# EAGLE design SRAM 4MB 2048kbx8 CPLD_v1_2 (EAGLE 6.4)
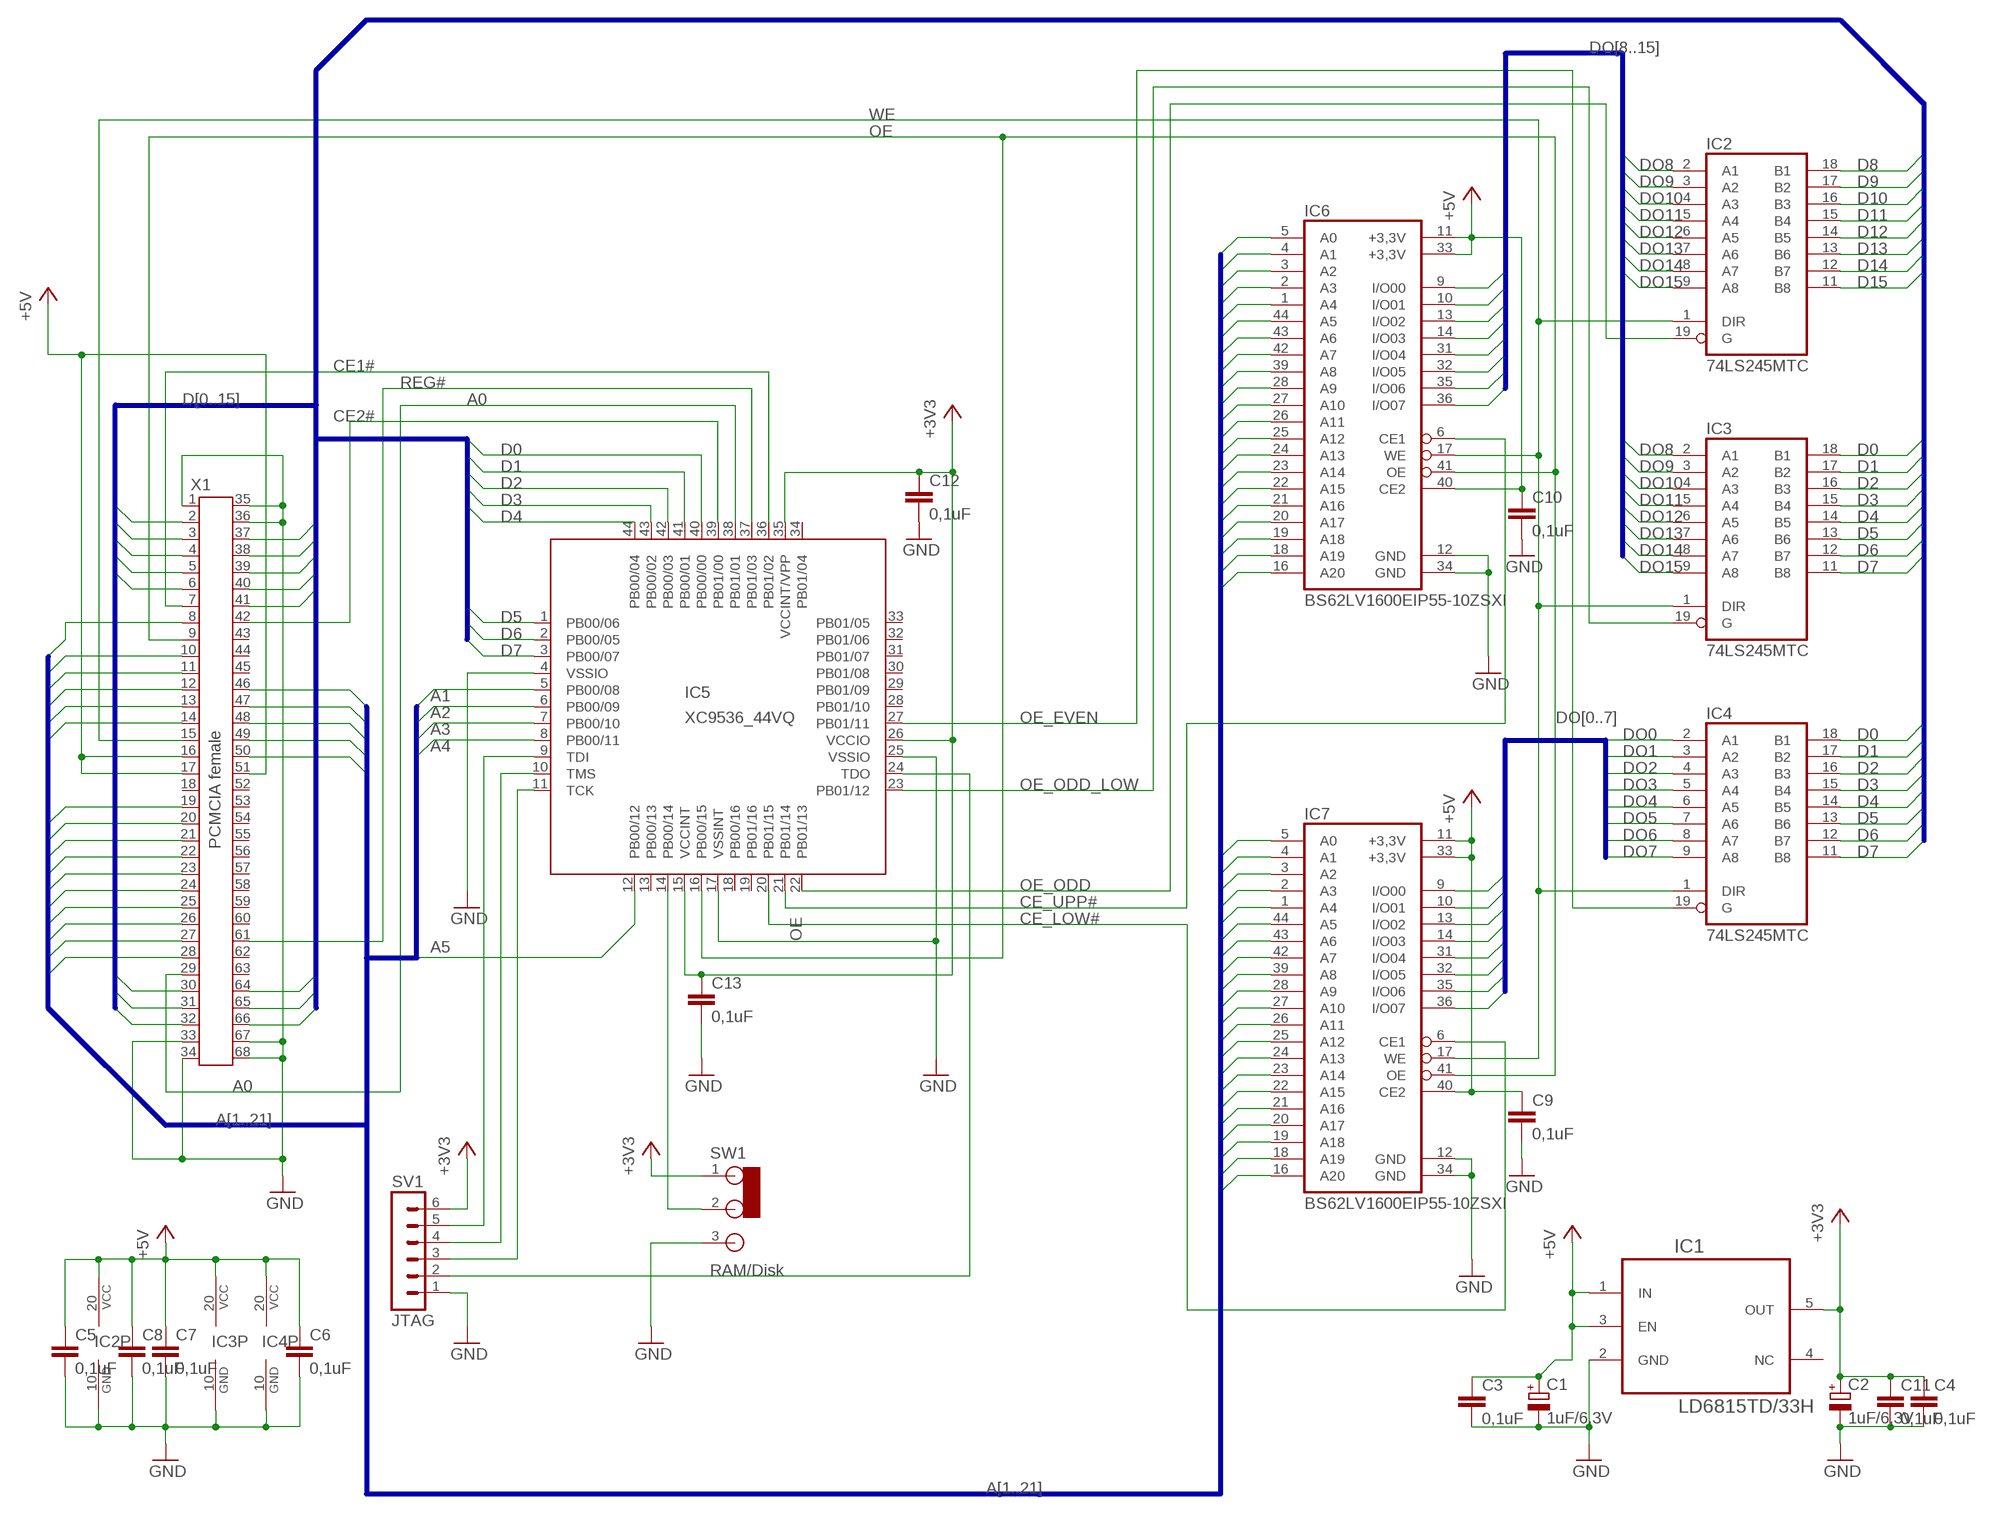
[diagram p0: schematic, sheet 1]

## Parts
C1  1uF/6,3V  CPOL-EUA/3216-18R  [A/3216-18R]
C2  1uF/6,3V  CPOL-EUA/3216-18R  [A/3216-18R]
C3  0,1uF  C-EUC0603  [C0603]
C4  0,1uF  C-EUC0603  [C0603]
C5  0,1uF  C-EUC0603  [C0603]
C6  0,1uF  C-EUC0603  [C0603]
C7  0,1uF  C-EUC0603  [C0603]
C8  0,1uF  C-EUC0603  [C0603]
C9  0,1uF  C-EUC0603  [C0603]
C10  0,1uF  C-EUC0603  [C0603]
C11  0,1uF  C-EUC0603  [C0603]
C12  0,1uF  C-EUC0603  [C0603]
C13  0,1uF  C-EUC0603  [C0603]
IC1  LD6815TD/33H  [SOT95P275X110-5N]
IC2  74LS245MTC  [TSSOP20]
IC3  74LS245MTC  [TSSOP20]
IC4  74LS245MTC  [TSSOP20]
IC5  XC9536_44VQ  [SQFP-S-10X10-44]
IC6  BS62LV1600EIP55-10ZSXI  [TSOPII-Z44]
IC7  BS62LV1600EIP55-10ZSXI  [TSOPII-Z44]
SV1  JTAG  MA06-1  [MA06-1]
SW1  RAM/Disk  AYZ0102AGRLC  [SWITCH2]
X1  PCMCIA female  9M681X03TB9M681Z04  [9M681X04]

## Nets
+3V3 [+3.3V]: C2.+ C4.1 C11.1 C12.1 C13.1 IC1.5(OUT) IC5.15(VCCINT) IC5.26(VCCIO) IC5.35(VCCINT/VPP) SV1.6 SW1.1
+5V [+5V]: C1.+ C3.1 C5.1 C6.1 C7.1 C8.1 C9.1 C10.1 IC1.1(IN) IC1.3(EN) IC2.20(VCC) IC3.20(VCC) IC4.20(VCC) IC6.11(+3,3V) IC6.33(+3,3V) IC6.40(CE2) IC7.11(+3,3V) IC7.33(+3,3V) IC7.40(CE2) X1.16 X1.17 X1.51
A0: IC5.38(PB01/01) X1.29
A1: IC5.5(PB00/08) IC6.5(A0) IC7.5(A0) X1.28
A2: IC5.6(PB00/09) IC6.4(A1) IC7.4(A1) X1.27
A3: IC5.7(PB00/10) IC6.3(A2) IC7.3(A2) X1.26
A4: IC5.8(PB00/11) IC6.2(A3) IC7.2(A3) X1.25
A5: IC5.12(PB00/12) IC6.1(A4) IC7.1(A4) X1.24
A6: IC6.44(A5) IC7.44(A5) X1.23
A7: IC6.43(A6) IC7.43(A6) X1.22
A8: IC6.42(A7) IC7.42(A7) X1.12
A9: IC6.39(A8) IC7.39(A8) X1.11
A10: IC6.28(A9) IC7.28(A9) X1.8
A11: IC6.27(A10) IC7.27(A10) X1.10
A12: IC6.26(A11) IC7.26(A11) X1.21
A13: IC6.25(A12) IC7.25(A12) X1.13
A14: IC6.24(A13) IC7.24(A13) X1.14
A15: IC6.23(A14) IC7.23(A14) X1.20
A16: IC6.22(A15) IC7.22(A15) X1.19
A17: IC6.21(A16) IC7.21(A16) X1.46
A18: IC6.20(A17) IC7.20(A17) X1.47
A19: IC6.19(A18) IC7.19(A18) X1.48
A20: IC6.18(A19) IC7.18(A19) X1.49
A21: IC6.16(A20) IC7.16(A20) X1.50
CE1#: IC5.36(PB01/02) X1.7
CE2#: IC5.39(PB01/00) X1.42
CE_LOW#: IC5.20(PB01/15) IC7.6(CE1)
CE_UPP#: IC5.21(PB01/14) IC6.6(CE1)
D0: IC3.18(B1) IC4.18(B1) IC5.40(PB00/00) X1.30
D1: IC3.17(B2) IC4.17(B2) IC5.41(PB00/01) X1.31
D2: IC3.16(B3) IC4.16(B3) IC5.42(PB00/03) X1.32
D3: IC3.15(B4) IC4.15(B4) IC5.43(PB00/02) X1.2
D4: IC3.14(B5) IC4.14(B5) IC5.44(PB00/04) X1.3
D5: IC3.13(B6) IC4.13(B6) IC5.1(PB00/06) X1.4
D6: IC3.12(B7) IC4.12(B7) IC5.2(PB00/05) X1.5
D7: IC3.11(B8) IC4.11(B8) IC5.3(PB00/07) X1.6
D8: IC2.18(B1) X1.64
D9: IC2.17(B2) X1.65
D10: IC2.16(B3) X1.66
D11: IC2.15(B4) X1.37
D12: IC2.14(B5) X1.38
D13: IC2.13(B6) X1.39
D14: IC2.12(B7) X1.40
D15: IC2.11(B8) X1.41
DO0: IC4.2(A1) IC7.9(I/O00)
DO1: IC4.3(A2) IC7.10(I/O01)
DO2: IC4.4(A3) IC7.13(I/O02)
DO3: IC4.5(A4) IC7.14(I/O03)
DO4: IC4.6(A5) IC7.31(I/O04)
DO5: IC4.7(A6) IC7.32(I/O05)
DO6: IC4.8(A7) IC7.35(I/O06)
DO7: IC4.9(A8) IC7.36(I/O07)
DO8: IC2.2(A1) IC3.2(A1) IC6.9(I/O00)
DO9: IC2.3(A2) IC3.3(A2) IC6.10(I/O01)
DO10: IC2.4(A3) IC3.4(A3) IC6.13(I/O02)
DO11: IC2.5(A4) IC3.5(A4) IC6.14(I/O03)
DO12: IC2.6(A5) IC3.6(A5) IC6.31(I/O04)
DO13: IC2.7(A6) IC3.7(A6) IC6.32(I/O05)
DO14: IC2.8(A7) IC3.8(A7) IC6.35(I/O06)
DO15: IC2.9(A8) IC3.9(A8) IC6.36(I/O07)
GND [Ground]: C1.- C2.- C3.2 C4.2 C5.2 C6.2 C7.2 C8.2 C9.2 C10.2 C11.2 C12.2 C13.2 IC1.2(GND) IC2.10(GND) IC3.10(GND) IC4.10(GND) IC5.4(VSSIO) IC5.17(VSSINT) IC5.25(VSSIO) IC6.12(GND) IC6.34(GND) IC7.12(GND) IC7.34(GND) SV1.1 SW1.3 X1.1 X1.33 X1.34 X1.35 X1.36 X1.67 X1.68
N$1: IC5.24(TDO) SV1.2
N$2: IC5.11(TCK) SV1.3
N$3: IC5.10(TMS) SV1.4
N$4: IC5.9(TDI) SV1.5
N$8: IC5.14(PB00/14) SW1.2
OE: IC5.16(PB00/15) IC6.41(OE) IC7.41(OE) X1.9
OE_EVEN: IC4.19(G) IC5.27(PB01/11)
OE_ODD: IC2.19(G) IC5.22(PB01/13)
OE_ODD_LOW: IC3.19(G) IC5.23(PB01/12)
REG#: IC5.37(PB01/03) X1.61
WE: IC2.1(DIR) IC3.1(DIR) IC4.1(DIR) IC6.17(WE) IC7.17(WE) X1.15
Unconnected: IC1.4(NC) IC5.13(PB00/13) IC5.18(PB00/16) IC5.19(PB01/16) IC5.28(PB01/10) IC5.29(PB01/09) IC5.30(PB01/08) IC5.31(PB01/07) IC5.32(PB01/06) IC5.33(PB01/05) IC5.34(PB01/04) X1.18 X1.43 X1.44 X1.45 X1.52 X1.53 X1.54 X1.55 X1.56 X1.57 X1.58 X1.59 X1.60 X1.62 X1.63

## Buses
DO[8..15]
DO[0..7]
D[0..15]
A[1..21]

## Library data of the parts
C1 C2 = resistor:CPOL-EU: POLARIZED CAPACITOR, European symbol
C3-C13 = resistor:C-EU: CAPACITOR, European symbol
IC1 = NXP:LD6815TD/33H: LDO, 5.5V, 0.25VDO, 0.15A, 3.3V, 5TSOP; MPN: LD6815TD/33H; OC_FARNELL: 2308302; OC_NEWARK: 69W9575; PACKAGE: TSOP-5; SUPPLIER: NXP
IC2-IC4 = 74xx-us:74*245: Octal BUS TRANSCEIVER, 3-state
IC5 = xilinx-xc9:XC9536_44VQ: xc9536_pc44 XC9500 In-System Programmable CPLD Family Auto generated by make-symbol-device-package-bsdl.ulp Rev. 34 Source: xc9536_vq44.bsd; MPN: XC9536-15VQG44C; OC_FARNELL: 1193227; OC_NEWARK: 98K3377
IC6 IC7 = BSI_By_element14_Batch_1:BS62LV1600EIP55: Source: CYPRESS cy7c1059dv33_8.pdf
SV1 = con-lstb:MA06-1: PIN HEADER; OC_FARNELL: unknown; OC_NEWARK: unknown
SW1 = amiga:AYZ0102AGRLC: SWITCH
X1 = 3M:9M681X03TB

## Net classes
0 default: width 0.102 mm
1 Ground: width 0.254 mm
2 +5V: width 0.254 mm
3 +3.3V: width 0.254 mm

## Board
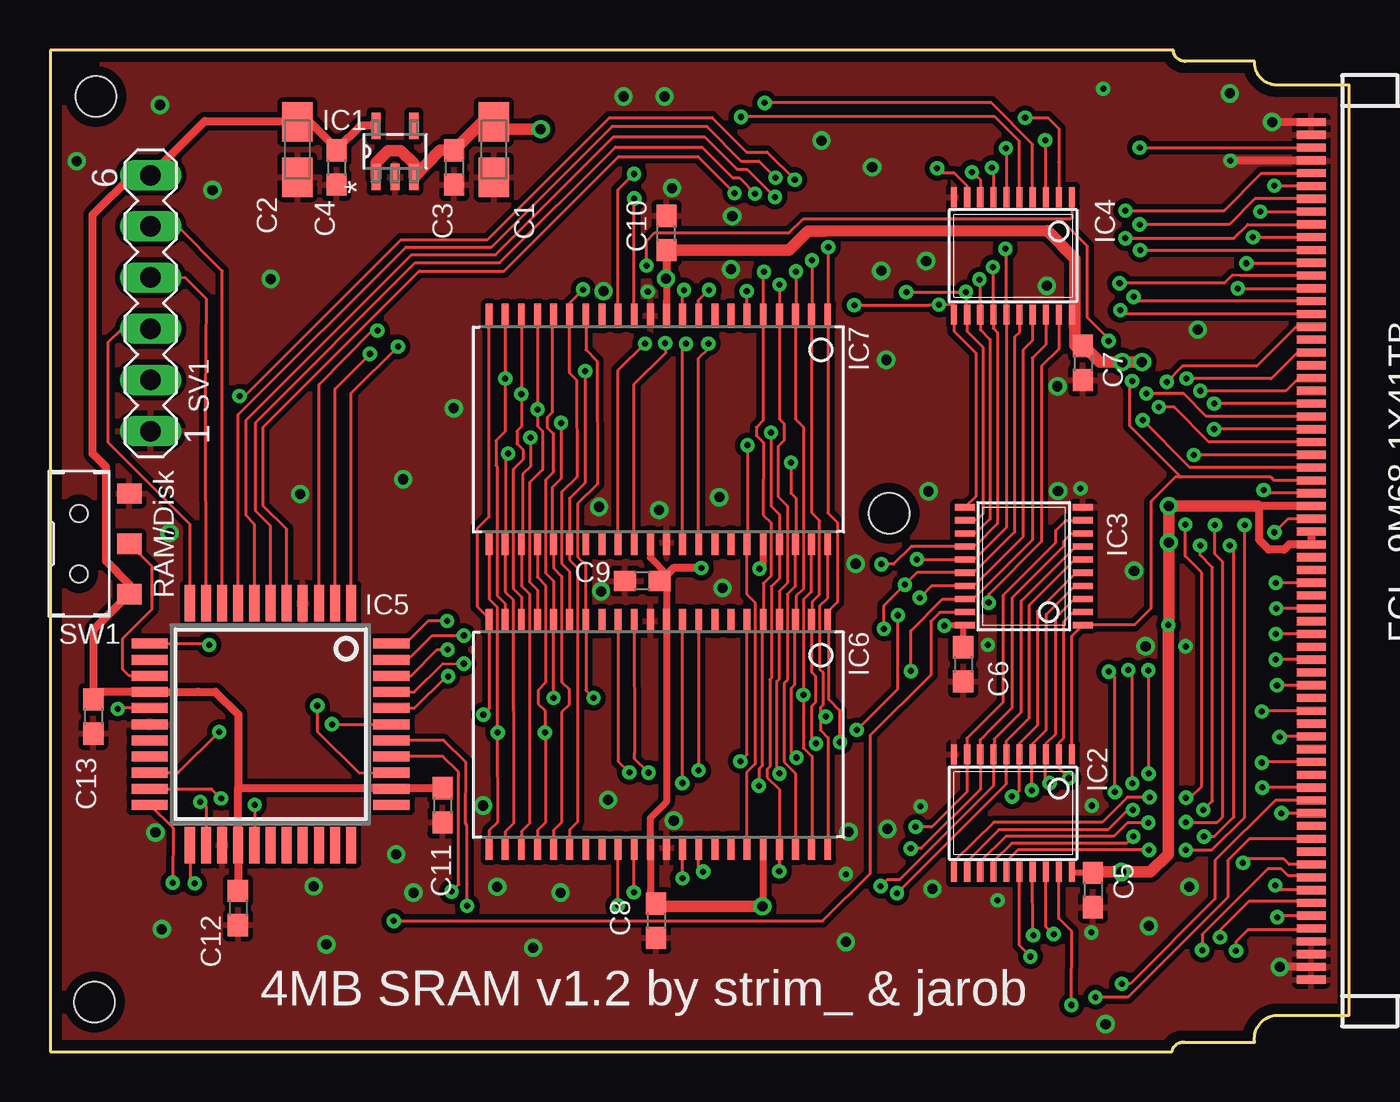
[diagram p1: board, top side]
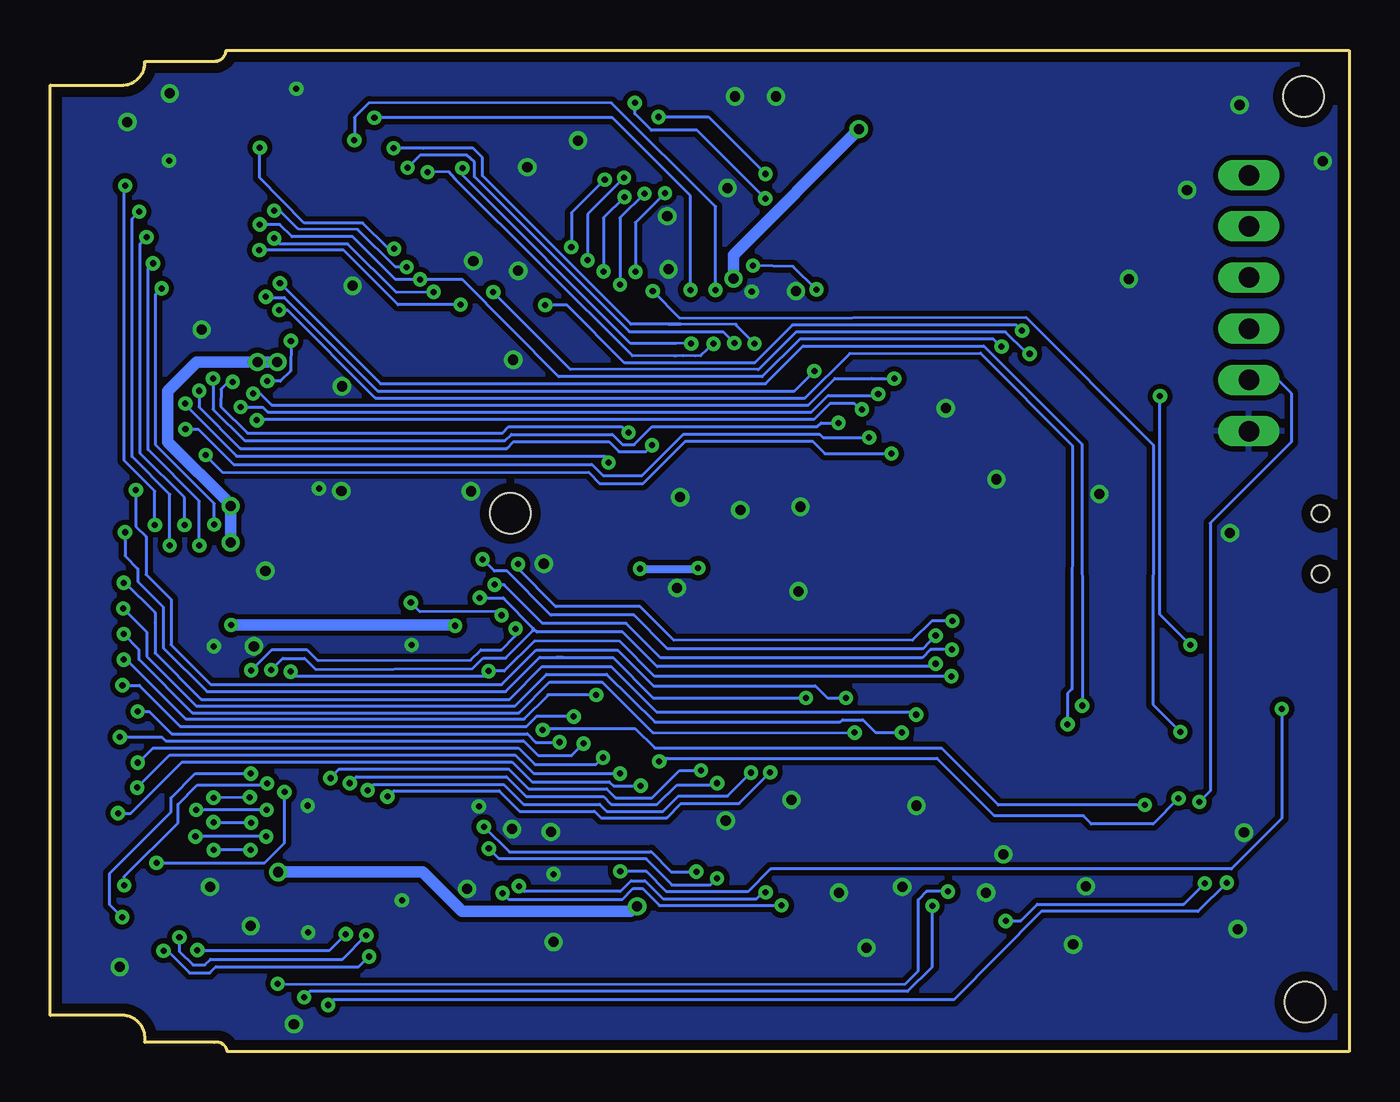
[diagram p2: board, bottom side, seen from below]

Size 64.43 x 49.67 mm. Coordinates in mm from the lower left corner, seen from the top.
Outline: 0,0 55.65,0 arc-90 56.28,0.46 59.74,0.46 arc-90 60.73,1.79 64.43,1.79 64.43,47.94 60.8,47.94 arc-90 59.74,49.13 56.31,49.13 arc-90 55.71,49.67 0,49.67 0,0
Copper layers (1*16): Top 0.035mm / dielectric 1.5mm / Bottom 0.035mm
Design rules "default *": minimum track width 0.015mm, minimum drill 0.03mm, track to track 4mil, track to pad 6mil, pad to pad 6mil, via to via 6mil, smd to smd 6mil, copper to edge 20mil, drill to drill 8mil, minimum pad ring 10mil, minimum via ring 8mil, stop-mask expansion 4mil, vias tented up to drill 20mil, thermal gap 10mil
Holes 2 mm at 2.19,2.46 2.25,47.38 41.61,26.7

### Footprints (pad centres in the part's own frame; a part is rotated, then mirrored left to right if it is on the bottom)
A/3216-18R = smd 1.95 x 1.5: + 1.375,0; - -1.375,0
C0603 = smd 1.1 x 1: 1 -0.85,0; 2 0.85,0
SOT95P275X110-5N = smd 1.321 x 0.457: 1 -1.27,0.94; 2 -1.27,0; 3 -1.27,-0.94; 4 1.27,-0.94; 5 1.27,0.94
TSSOP20 = smd 0.305 x 0.991: 1 -2.925,-2.918; 2 -2.275,-2.918; 3 -1.625,-2.918; 4 -0.975,-2.918; 5 -0.325,-2.918; 6 0.325,-2.918; 7 0.975,-2.918; 8 1.625,-2.918; 9 2.275,-2.918; 10 2.925,-2.918; 11 2.925,2.918; 12 2.275,2.918; 13 1.625,2.918; 14 0.975,2.918; 15 0.325,2.918; 16 -0.325,2.918; 17 -0.975,2.918; 18 -1.625,2.918; 19 -2.275,2.918; 20 -2.925,2.918
SQFP-S-10X10-44 = smd 0.5 x 1.8: 1 -4,-6; 2 -3.2,-6; 3 -2.4,-6; 4 -1.6,-6; 5 -0.8,-6; 6 0,-6; 7 0.8,-6; 8 1.6,-6; 9 2.4,-6; 10 3.2,-6; 11 4,-6; 23 4,6; 24 3.2,6; 25 2.4,6; 26 1.6,6; 27 0.8,6; 28 0,6; 29 -0.8,6; 30 -1.6,6; 31 -2.4,6; 32 -3.2,6; 33 -4,6 | smd 1.8 x 0.5: 12 6,-4; 13 6,-3.2; 14 6,-2.4; 15 6,-1.6; 16 6,-0.8; 17 6,0; 18 6,0.8; 19 6,1.6; 20 6,2.4; 21 6,3.2; 22 6,4; 34 -6,4; 35 -6,3.2; 36 -6,2.4; 37 -6,1.6; 38 -6,0.8; 39 -6,0; 40 -6,-0.8; 41 -6,-1.6; 42 -6,-2.4; 43 -6,-3.2; 44 -6,-4
TSOPII-Z44 = smd 0.34 x 1.2: 1 -8.4,-5.627; 2 -7.6,-5.627; 3 -6.8,-5.627; 4 -6,-5.627; 5 -5.2,-5.627; 6 -4.4,-5.627; 7 -3.6,-5.627; 8 -2.8,-5.627; 9 -2,-5.627; 10 -1.2,-5.627; 11 -0.4,-5.627; 12 0.4,-5.627; 13 1.2,-5.627; 14 2,-5.627; 15 2.8,-5.627; 16 3.6,-5.627; 17 4.4,-5.627; 18 5.2,-5.627; 19 6,-5.627; 20 6.8,-5.627; 21 7.6,-5.627; 22 8.4,-5.627; 23 8.4,5.627; 24 7.6,5.627; 25 6.8,5.627; 26 6,5.627; 27 5.2,5.627; 28 4.4,5.627; 29 3.6,5.627; 30 2.8,5.627; 31 2,5.627; 32 1.2,5.627; 33 0.4,5.627; 34 -0.4,5.627; 35 -1.2,5.627; 36 -2,5.627; 37 -2.8,5.627; 38 -3.6,5.627; 39 -4.4,5.627; 40 -5.2,5.627; 41 -6,5.627; 42 -6.8,5.627; 43 -7.6,5.627; 44 -8.4,5.627
MA06-1 = drill 1.016 long: 1 -6.35,0; 2 -3.81,0; 3 -1.27,0; 4 1.27,0; 5 3.81,0; 6 6.35,0
SWITCH2 = smd 1 x 1.2: 1 -2.5,1; 2 0,1; 3 2.5,1 | hole 0.85: -1.5,3.5; 1.5,3.5
9M681X04 = smd 0.406 x 1.422: 1 -20.955,-3.175; 2 -19.685,-3.175; 3 -18.415,-3.175; 4 -17.145,-3.175; 5 -15.875,-3.175; 6 -14.605,-3.175; 7 -13.335,-3.175; 8 -12.065,-3.175; 9 -10.795,-3.175; 10 -9.525,-3.175; 11 -8.255,-3.175; 12 -6.985,-3.175; 13 -5.715,-3.175; 14 -4.445,-3.175; 15 -3.175,-3.175; 16 -1.905,-3.175; 17 -0.635,-3.175; 18 0.635,-3.175; 19 1.905,-3.175; 20 3.175,-3.175; 21 4.445,-3.175; 22 5.715,-3.175; 23 6.985,-3.175; 24 8.255,-3.175; 25 9.525,-3.175; 26 10.795,-3.175; 27 12.065,-3.175; 28 13.335,-3.175; 29 14.605,-3.175; 30 15.875,-3.175; 31 17.145,-3.175; 32 18.415,-3.175; 33 19.685,-3.175; 34 20.955,-3.175; 35 -20.32,-3.175; 36 -19.05,-3.175; 37 -17.78,-3.175; 38 -16.51,-3.175; 39 -15.24,-3.175; 40 -13.97,-3.175; 41 -12.7,-3.175; 42 -11.43,-3.175; 43 -10.16,-3.175; 44 -8.89,-3.175; 45 -7.62,-3.175; 46 -6.35,-3.175; 47 -5.08,-3.175; 48 -3.81,-3.175; 49 -2.54,-3.175; 50 -1.27,-3.175; 51 0,-3.175; 52 1.27,-3.175; 53 2.54,-3.175; 54 3.81,-3.175; 55 5.08,-3.175; 56 6.35,-3.175; 57 7.62,-3.175; 58 8.89,-3.175; 59 10.16,-3.175; 60 11.43,-3.175; 61 12.7,-3.175; 62 13.97,-3.175; 63 15.24,-3.175; 64 16.51,-3.175; 65 17.78,-3.175; 66 19.05,-3.175; 67 20.32,-3.175; 68 21.59,-3.175

### Placement (x,y rotation side)
C1  22,44.75 90 top
C2  12.26,44.75 90 top
C3  20.03,43.86 270 top
C4  14.19,43.86 270 top
C5  51.72,8.01 270 top
C6  45.28,19.21 270 top
C7  51.23,34.16 270 top
C8  30.05,6.49 270 top
C9  29.36,23.35 180 top
C10  30.56,40.61 90 top
C11  19.45,12.22 270 top
C12  9.3,7.12 270 top
C13  2.13,16.62 270 top
IC1  17.09,44.65 90 top
IC2  47.75,11.82 180 top
IC3  48.29,24.08 90 top
IC4  47.75,39.48 180 top
IC5  10.92,16.24 180 top
IC6  30.16,15.73 180 top
IC7  30.16,30.87 180 top
SV1  4.97,37.13 90 top
SW1  4.92,25.19 90 top
X1  65.72,25.16 270 top

### Tracks (layer width: path | path; a pad name or v marks a point on that pad's centre or on a via)
+3V3
  Top 0.305: 2.16,17.5 2.19,17.53 2.19,17.84
  Top 0.406: IC1.5 15.38,45.93 14.21,44.76 14.21,44.69 C4.1 14.38,44.61 12.93,46.06 12.26,46.06 C2.+ 12.12,46.16 7.66,46.16 SV1.6 5.02,43.52 4.08,43.49 2.1,41.51 2.1,29.67 2.76,29 2.76,24.33 3.92,23.17 SW1.1 2.16,20.93 2.16,17.5 C13.1 | 2.19,17.84 IC5.15 7.33,17.84 8.19,17.84 9.32,16.73 9.32,13.11 | IC5.26 | IC5.26 9.32,8.4 C12.1 | C12.1 9.37,7.99 | IC5.26 9.32,13.11 | 9.32,13.11 9.41,13.08 16.02,13.08 16.19,13.06 IC5.35 16.95,13.07 C11.1 | C12.1
+5V  (via drill 0.3, 0.5)
  Top 0.305: v44.35,21.13 45.35,21.13 IC3.20 45.28,21.06 C6.1 | v55.46,21.16 55.46,21.2 55.49,21.22 | 50.83,35.03 51.14,35.04 C7.1 50.69,35.15 IC4.20 | C5.1 50.72,8.86 IC2.20
  Top 0.34: IC7.11 30.56,36.87 | 30.56,36.87 30.56,37.24 | 29.76,11.59 30.56,12.39 IC6.11 30.56,21.38 30.56,23.18 | 29.76,11.59 | IC6.40 35.36,7.25 | 30.18,7.48 29.79,7.56 29.76,7.98 IC6.33 29.76,11.59 | IC7.40 35.36,24.14 v35.18,23.95 | v30.54,38.35 30.56,38.32 30.56,36.87 | IC7.33 29.76,24.5 30.59,23.67 30.56,23.18 | 30.54,23.22 30.56,23.22 30.56,23.18
  Top 0.406: X1.16 59.9,27.06 59.96,27 59.96,25.38 60.44,24.9 61.2,24.9 61.46,25.16 X1.51 X1.17 62.45,25.79 | 50.83,35.03 51.29,34.97 | 22.55,45.76 22.48,45.83 C1.+ 21.44,46.12 | 35.36,7.25 v35.32,7.21 35.36,7.21 | 30.44,7.21 30.18,7.48 30.05,7.35 C8.1 | v32.29,23.98 30.91,23.98 30.59,23.67 | 30.54,23.22 30.34,23.22 C9.1 | v30.54,38.35 30.56,38.37 C10.1 | v55.46,21.16 | 51.76,8.9 C5.1
  Top 0.559: 59.9,27.06 v55.49,27.06 55.49,21.22 | 50.83,35.03 50.83,39.34 49.45,40.72 38.42,40.71 37.59,40.71 36.64,39.75 C10.1 | 22.55,45.76 v24.32,45.76 | 21.44,46.12 C3.1 19.33,44.71 IC1.3 18.03,44.04 17.37,44.7 16.76,44.7 16.15,44.09 IC1.1 | 35.36,7.21 30.44,7.21 | v54.15,34.21 52.05,34.21 51.29,34.97 | v55.46,21.16 55.46,9.79 54.57,8.9 v53.12,8.9 51.76,8.9
  Bottom 0.305: v44.35,21.13 44.39,21.16
  Bottom 0.406: 35.64,6.95 v35.32,7.21 | 55.49,27.13 v55.49,27.06 | v35.18,23.95 32.32,23.95 v32.29,23.98
  Bottom 0.559: v24.32,45.76 30.54,39.52 v30.54,38.35 | 35.64,6.95 44.01,6.95 45.96,8.9 v53.12,8.9 | 55.49,27.13 58.6,30.24 58.6,32.78 57.16,34.21 v54.15,34.21 v53.17,34.21 | v55.49,25.25 v55.49,27.06 | 44.39,21.16 v55.46,21.16
A0  (via drill 0.3)
  Top 0.15: X1.29 59.49,10.55 58.41,9.47 58.41,7.65 53.45,2.69 v51.84,2.69 | v20.68,7.23 20.68,8.32 20.67,8.84 20.67,11.19 20.61,11.32 20.61,14.35 19.51,15.44 18.71,15.44 IC5.38
  Bottom 0.15: 51.82,2.69 v51.84,2.69 51.56,2.98 21.91,2.98 20.68,4.2 v20.68,7.23
A1  (via drill 0.3)
  Top 0.15: v33.94,42.59 32.13,44.4 28.19,44.4 22.52,38.72 18.3,38.72 10.54,30.96 10.54,27.1 11.72,25.91 IC5.5 | v35.4,38.68 35.36,38.74 IC7.5 35.36,31.31 35.02,30.97 35.02,30.55 35.36,30.21 35.36,26.63 35.76,26.22 35.76,23.62 35.37,23.22 IC6.5 35.34,21.33 35.34,14.2 35.18,14.04 35.18,13.19 v35.14,13.19 | X1.28 v61.07,11.82
  Bottom 0.15: v33.94,42.59 35.4,41.13 v35.4,38.68 | v61.07,11.82 60.44,11.82 57.9,14.36 41.53,14.36 40.54,13.38 36.7,13.38 36.48,13.19 v35.14,13.19
A2  (via drill 0.3)
  Top 0.15: v34.96,42.56 34.18,43.35 33.85,43.35 32.32,44.88 28.04,44.88 22.29,39.13 18.1,39.13 10.16,31.18 10.16,26.84 10.92,26.08 IC5.6 | v36.16,38.05 36.16,38.18 IC7.4 36.16,31.38 36.38,31.16 36.38,30.3 36.1,30.02 36.1,28.75 36.1,27.53 36.56,27.06 36.56,23.24 36.16,22.84 IC6.4 36.16,18.49 36.04,18.36 36.04,13.98 36.13,13.89 v36.16,13.79 | X1.27 v60.12,13.09
  Bottom 0.15: v34.96,42.56 36.17,41.37 v36.16,38.05 | v60.12,13.09 58.5,14.71 41.37,14.71 40.45,13.79 v36.16,13.79
A3  (via drill 0.3)
  Top 0.15: v35.94,42.4 34.56,43.77 34.07,43.76 32.48,45.35 27.9,45.35 22.09,39.53 17.91,39.53 9.72,31.34 9.72,26.59 10.12,26.15 IC5.7 | v36.98,38.7 36.98,36.44 IC7.3 36.96,31.38 37.37,30.97 37.36,30.95 37.36,22.95 36.99,22.59 36.99,21.38 IC6.3 36.93,21.32 36.93,18.21 36.77,18.05 36.77,14.83 36.96,14.64 v37.01,14.58 | X1.26 60.12,14.36 v60.09,14.33
  Bottom 0.15: v35.94,42.4 36.99,41.36 v36.98,38.7 | v60.09,14.33 60.06,14.33 59.33,15.06 41.21,15.06 40.39,14.24 37.37,14.24 37.14,14.47 v37.01,14.58
A4  (via drill 0.3)
  Top 0.15: IC5.8 9.32,31.6 17.63,39.92 21.88,39.92 27.86,45.89 32.58,45.89 34.26,44.18 35.15,44.18 v35.97,43.35 | v37.78,39.26 37.78,36.52 IC7.2 37.76,26.73 38.16,26.34 38.16,22.68 37.78,22.3 37.78,21.38 IC6.2 37.78,21.34 37.78,18.81 37.97,18.62 37.97,17.35 37.78,17.16 37.78,15.47 v37.97,15.28 | X1.25 61.01,15.63 v60.98,15.6
  Bottom 0.15: v35.97,43.35 37.78,41.54 v37.78,39.26 | v60.98,15.6 58.9,15.6 58.71,15.41 40.96,15.41 40.23,14.68 38.57,14.68 v37.97,15.28
A5  (via drill 0.3)
  Top 0.15: v36.93,43.26 35.55,44.63 34.54,44.62 32.83,46.34 27.75,46.34 21.69,40.27 17.39,40.27 9.63,32.52 v9.38,32.52 | v38.59,39.91 38.58,36.6 IC7.1 38.56,26.73 39.05,26.24 39.05,22.3 38.58,21.82 38.58,21.37 IC6.1 38.62,21.25 38.62,17.46 39.17,16.9 v39.17,15.35 | X1.24 60.12,16.9 v60.09,16.87 | IC5.12 7.81,20.24 v7.87,20.17
  Bottom 0.15: v36.93,43.26 38.59,41.61 v38.59,39.91 | v60.09,16.87 59.52,16.87 58.41,15.76 40.77,15.76 40.35,15.35 v39.17,15.35 | v7.87,20.17 9.38,21.68 v9.38,32.52
A6  (via drill 0.3)
  Top 0.15: 38.2,16.62 38.2,17.07 38.32,17.19 38.32,18.81 38.16,18.97 38.16,22.1 38.56,22.5 IC7.44 | 38.2,16.62 38.2,15.94 38.58,15.56 38.58,10.12 IC6.44 | X1.23 v60.85,18.17 | v38.47,16.62 38.2,16.62
  Bottom 0.15: v60.85,18.17 60.01,18.17 57.99,16.14 40.8,16.14 40.33,16.61 40.33,16.62 v38.47,16.62
A7  (via drill 0.3)
  Top 0.15: 37.36,17.74 37.36,22.42 37.76,22.82 IC7.43 | 37.36,17.74 37.36,15.06 37.78,14.64 37.78,10.12 IC6.43 | X1.22 v60.79,19.44 | v37.35,17.7 37.35,17.73 37.36,17.74
  Bottom 0.15: v60.79,19.44 60.69,19.48 57.71,16.49 40.93,16.49 39.74,17.67 39.74,17.7 v37.35,17.7
A8  (via drill 0.3)
  Top 0.15: IC6.42 36.96,13.8 36.39,14.37 36.39,18.28 36.56,18.45 36.56,22.69 36.96,23.09 IC7.42 36.99,25.27 36.99,27.45 36.73,27.7 v36.73,29.22 | X1.12 v57.73,32.14
  Bottom 0.15: v57.73,32.14 57.79,32.14 55.19,29.54 36.89,29.54 v36.73,29.22
A9  (via drill 0.3)
  Top 0.15: IC6.39 34.54,10.12 34.54,13.86 34.96,14.27 34.96,22.28 34.56,22.68 IC7.39 34.58,25.26 v34.58,30.08 | X1.11 61.93,33.41 61.3,32.78 v57.04,32.78
  Bottom 0.15: v57.04,32.78 57.05,31.98 55,29.92 41.78,29.93 41.45,30.26 36.72,30.26 36.23,29.76 34.89,29.76 v34.58,30.08
A10  (via drill 0.3)
  Top 0.15: 25.75,10.11 IC6.28 25.76,11 26.16,11.4 26.16,23.99 25.76,24.39 IC7.28 25.75,25.26 25.75,27.44 26.51,28.21 26.51,33.74 v26.53,33.76 | X1.8 53.96,37.22 v53.74,37.45
  Bottom 0.15: v53.74,37.45 53.74,37.41 52.82,37.41 48.18,32.78 27.51,32.78 v26.53,33.76
A11  (via drill 0.3)
  Top 0.15: IC6.27 24.96,10.97 25.37,11.38 25.37,16.84 25.72,17.19 25.72,17.98 25.36,18.33 25.36,23.58 24.96,23.98 IC7.27 24.89,25.32 24.89,27.98 25.34,28.43 v25.34,31.19 25.34,31.22 | X1.10 61.87,34.68 60.57,33.38 v56.36,33.38
  Bottom 0.15: v56.36,33.38 56.36,31.86 54.78,30.3 41.88,30.3 41.56,30.62 36.54,30.62 36.04,30.11 35.46,30.11 34.58,31 26.38,31 26.19,31.19 v25.34,31.19
A12  (via drill 0.3)
  Top 0.15: IC6.26 24.16,10.97 24.57,11.38 24.57,15.76 v24.53,15.82 24.53,16.92 24.19,17.25 24.19,17.92 24.56,18.3 24.56,23.13 24.16,23.53 IC7.26 | X1.21 v60.79,20.71
  Bottom 0.15: v24.53,15.82 34.53,15.81 37.05,18.33 39.66,18.33 41.18,16.81 57.39,16.81 60.03,19.44 60.03,19.93 v60.79,20.71
A13  (via drill 0.3)
  Top 0.15: IC6.25 23.36,10.92 23.76,11.32 23.76,22.71 23.36,23.1 IC7.25 23.43,25.32 23.43,28.65 23.81,29.03 v23.81,30.46 | X1.13 v57.73,30.87
  Bottom 0.15: v57.73,30.87 57.09,30.87 55.35,29.13 37.56,29.13 36.99,28.56 35.1,28.56 33.03,30.63 26.26,30.63 26.09,30.46 v23.81,30.46
A14  (via drill 0.3)
  Top 0.15: 22.57,10.11 IC6.24 22.56,10.9 22.97,11.32 22.96,22.42 22.56,22.8 IC7.24 22.57,25.26 22.57,29.41 22.7,29.44 v22.7,29.67 | X1.14 56.92,29.6 v56.72,29.59
  Bottom 0.15: v56.72,29.59 56.72,29.57 55.91,28.75 37.71,28.73 37.18,28.17 35.03,28.17 32.93,30.28 26.61,30.28 26.01,29.67 v22.7,29.67
A15  (via drill 0.3)
  Top 0.15: 22.16,15.84 22.16,22.05 21.76,22.45 IC7.23 21.75,25.26 | 22.16,15.84 22.17,11.38 21.77,10.97 IC6.23 | X1.20 v60.82,21.98 | v22.19,15.82 22.16,15.84
  Bottom 0.15: v60.82,21.98 59.65,20.81 59.65,19.6 57.2,17.16 41.37,17.16 39.81,18.71 36.83,18.71 34.44,16.34 25.29,16.34 25.11,16.46 24.13,16.46 23.49,15.82 v22.19,15.82
A16  (via drill 0.3)
  Top 0.15: X1.19 v60.79,23.25 | IC7.22 21.76,26.54 21.18,25.95 21.18,22.08 21.77,21.48 21.77,21.51 IC6.22 21.76,17 v21.48,16.71
  Bottom 0.15: v60.79,23.25 60.76,23.29 59.24,21.78 59.23,21.28 59.24,19.77 56.94,17.47 41.66,17.47 40.04,19.09 36.61,19.09 34.35,16.84 21.6,16.84 v21.48,16.71
A17  (via drill 0.3)
  Top 0.15: IC7.21 v22.56,33.38 22.56,30.77 22.1,30.3 22.1,29.1 22.16,29.01 22.16,26.89 22.16,26.26 22.16,22.62 22.57,22.22 IC6.21 | X1.46 57.35,31.51 56.22,32.65 v54.37,32.65
  Bottom 0.15: v54.37,32.65 54.01,32.62 53.44,32.08 26.83,32.08 25.51,33.39 23.67,33.39 23.69,33.38 v22.56,33.38
A18  (via drill 0.3)
  Top 0.15: IC7.20 v23.36,32.62 23.36,30.99 23.15,30.78 23.15,30.16 23.46,29.84 23.46,29.39 22.96,28.89 22.96,22.97 23.37,22.55 23.37,21.32 IC6.20 | X1.47 57.48,30.24 55.75,31.97 v54.98,31.97
  Bottom 0.15: v23.36,32.62 23.37,32.52 23.37,32.56 25.84,32.56 26.67,31.73 53.64,31.73 53.89,31.97 v54.98,31.97
A19  (via drill 0.3)
  Top 0.15: IC7.19 v24.16,31.86 24.16,31.03 24.42,30.78 24.42,30.08 24.42,28.87 23.76,28.22 23.76,23.3 24.16,22.9 IC6.19 | X1.48 56.53,28.97 v54.18,31.32
  Bottom 0.15: v54.18,31.32 54.02,31.38 26.51,31.38 25.73,32.16 24.56,32.16 24.23,31.83 v24.16,31.86
A20  (via drill 0.3)
  Top 0.15: X1.49 60.34,27.7 v60.19,27.86 | v24.96,17.54 IC6.18 24.96,23.36 24.56,23.75 24.56,28.35 24.96,28.75 24.96,30.64 24.67,30.94 24.67,31.48 24.92,31.73 24.92,36.46 IC7.18
  Bottom 0.15: v60.19,27.86 60.19,26.05 59.68,25.54 59.68,23.66 58.44,22.43 58.44,20.17 56.47,18.21 42.04,18.21 40.32,19.92 36.29,19.92 34.51,18.14 26.48,18.14 25.88,17.54 v24.96,17.54
A21  (via drill 0.3)
  Top 0.15: X1.50 61.39,26.43 v60.73,25.76 | IC7.16 26.56,34.82 27.13,34.25 27.14,28.16 26.16,27.18 26.16,24.54 26.54,24.16 26.54,21.38 IC6.16 26.56,17.92 v26.94,17.54
  Bottom 0.15: v60.73,25.76 60.73,24.59 60.09,23.95 60.09,23.32 58.82,22.05 58.82,20.02 56.66,17.86 41.85,17.86 40.15,19.55 38.99,19.54 | 38.99,19.54 39.34,19.54 | 38.99,19.54 36.51,19.54 34.53,17.54 v26.94,17.54
CE1#  (via drill 0.3)
  Top 0.15: X1.7 59.07,38.49 58.64,38.51 58.24,38.11 v53.04,38.11 | v13.24,17.16 13.24,15.89 15.3,13.82 IC5.36
  Bottom 0.15: v53.04,38.11 48.06,33.13 37.43,33.13 36.6,33.13 28.94,33.13 27.08,35 18.13,35 13.25,30.14 v13.24,17.16
CE2#  (via drill 0.3)
  Top 0.15: X1.42 53.36,36.59 v53.07,36.78 | v13.97,16.24 IC5.39
  Bottom 0.15: v13.97,16.24 13.97,17.76 13.75,17.98 13.75,18.01 13.74,30.07 18.29,34.65 24.77,34.64 26.99,32.43 48.32,32.43 52.67,36.78 v53.07,36.78
CE_LOW#  (via drill 0.3)
  Top 0.15: v34.54,37.73 34.54,36.52 IC7.6 | IC5.20 6.35,13.84 v8.38,15.86
  Bottom 0.15: v34.54,37.73 33.21,36.4 16.03,36.43 9.72,30.1 9.73,17.22 v8.38,15.86
CE_UPP#  (via drill 0.3)
  Top 0.15: v34.23,14.4 34.56,14.73 IC6.6 | IC5.21 7.99,13.04 v8.46,12.56
  Bottom 0.15: v8.46,12.56 9.72,11.28 12.8,11.28 13.18,11.7 17.59,11.7 20.45,14.55 33.81,14.55 v34.23,14.4
D0  (via drill 0.3)
  Top 0.15: X1.30 61.46,9.28 61.18,9.56 59.43,9.56 v59.16,9.36 | v52.81,12.87 52.81,18.54 v52.51,18.85 | IC5.40 18.06,17.04 19.65,18.62 v19.72,18.62 | IC4.18 49.38,35.07 48.71,34.41 48.71,25.39 45.88,22.56 IC3.18 44.26,22.45 42.68,20.87 v42.68,18.87
  Bottom 0.15: v59.16,9.36 53.8,9.36 52.81,10.34 v52.81,12.87 | v19.72,18.62 34.45,18.62 36.16,20.33 40.41,20.36 41.91,18.87 v42.68,18.87 42.86,18.61 51.15,18.62 52.2,18.62 v52.51,18.85
D1  (via drill 0.3)
  Top 0.15: X1.31 61.07,8.01 v60.77,8.24 | IC5.41 18.05,17.84 19.48,19.25 v20.51,19.24 | IC4.17 48.73,35.28 48.25,34.79 48.25,25.53 45.91,23.19 IC3.17 | IC3.17 | IC3.17 43.71,23.09 v43.13,22.51 | v53.67,13.3 53.67,18.74 v53.47,18.94
  Bottom 0.15: v60.77,8.24 60.74,8.24 60.76,8.27 60.76,8.68 58.09,11.35 58.09,12.27 57.14,13.22 53.88,13.22 v53.67,13.3 | v20.51,19.24 20.59,19.24 20.74,19.09 34.32,19.09 36.04,20.81 40.29,20.81 40.48,21 | 40.48,21 41.92,22.46 41.97,22.51 v43.13,22.51 | v53.47,18.94 52.9,19.51 51.82,19.51 51.28,18.97 43.49,19 42.96,19.52 41.84,19.52 40.48,20.88 40.48,21
D2  (via drill 0.3)
  Top 0.15: IC5.42 17.89,18.64 19.19,19.94 v19.71,19.94 | IC4.16 48.08,35.68 47.83,35.43 47.82,25.77 45.85,23.79 IC3.16 | IC3.16 | IC3.16 42.98,23.76 v42.39,23.16 41.35,22.13 v41.35,20.97 | v54.48,13.79 54.48,18.9 v54.46,18.92 | X1.32 60.95,6.74 v60.87,6.67
  Bottom 0.15: v19.71,19.94 20.76,19.95 21.17,19.53 34.15,19.53 35.86,21.25 40.02,21.25 41.91,23.16 42.17,23.16 v42.39,23.16 | v60.87,6.67 61.49,7.28 61.49,8.84 58.44,11.89 58.44,12.59 57.23,13.79 v54.48,13.79 | v41.35,20.97 41.36,20.61 42.05,19.93 43.07,19.93 43.58,19.42 51.18,19.41 51.69,19.92 53.46,19.92 v54.46,18.92
D3  (via drill 0.3)
  Top 0.15: v47.37,39.83 47.43,39.69 IC4.15 47.43,26.01 45.88,24.46 IC3.15 | v54.04,44.84 X1.2 | IC5.43 17.72,19.44 18.94,20.63 v20.51,20.63 | IC3.15 | IC3.15 43.01,24.4 v42.98,24.42
  Bottom 0.15: v20.51,20.63 21.14,19.98 33.81,19.98 35.48,21.65 39.61,21.65 41.77,23.84 42.4,23.84 v42.98,24.42 | v47.37,39.83 47.65,39.83 48.93,41.11 51.83,41.11 54.04,43.34 v54.04,44.84
D4  (via drill 0.3)
  Top 0.15: v46.76,38.92 46.78,38.8 IC4.14 46.78,35.89 46.99,35.67 46.99,26.19 45.91,25.11 45.43,25.11 IC3.14 | v53.33,41.72 58.23,41.72 60.08,43.57 X1.3 | IC5.44 17.49,20.11 18.75,21.36 v19.68,21.36 | 45.82,25.06 45.4,25.03 IC3.14 | IC3.14 42.78,25.05 42.71,25.06 41.83,24.18 v41.23,24.18
  Bottom 0.15: v46.76,38.92 47.31,38.92 49.17,40.78 52.13,40.8 53.05,41.72 v53.33,41.72 | v19.68,21.36 20.69,21.36 21.66,20.42 33.5,20.4 35.17,22.07 39.36,22.07 41.25,23.98 v41.24,24.19 v41.23,24.18
D5  (via drill 0.3)
  Top 0.15: v46.09,38.3 46.13,38.13 IC4.13 46.13,35.81 46.61,35.32 46.61,26.42 45.91,25.72 45.39,25.72 IC3.13 45.75,25.7 | IC5.1 14.92,32.68 v17.24,34.97 | X1.4 59.75,42.3 58.48,41.03 v54.04,41.03
  Bottom 0.15: v17.24,34.97 17.65,35.35 27.24,35.35 29.11,33.48 39.21,33.48 43.99,38.3 v46.09,38.3 47.31,38.3 49.43,40.42 52.44,40.42 53.05,41.03 v54.04,41.03
D6  (via drill 0.3)
  Top 0.15: IC5.2 14.12,32.87 v15.85,34.61 | v42.46,37.67 43.03,37.67 v45.42,37.69 45.47,37.66 IC4.12 45.48,35.73 46.26,34.95 46.26,26.68 45.96,26.38 45.4,26.38 IC3.12 45.35,26.33 45.85,26.33 | v53.33,40.35 58.71,40.35 59.4,41.03 X1.5
  Bottom 0.15: v53.33,40.35 53.07,40.07 49.67,40.07 47.26,37.66 v45.42,37.69 | v15.85,34.61 16.04,34.69 17.05,35.7 27.43,35.7 29.31,33.83 38.64,33.86 v42.46,37.67
D7  (via drill 0.3)
  Top 0.15: IC5.3 13.32,33.1 15.97,35.76 v16.22,35.76 | v39.88,37.03 43.62,37.03 v44.08,37.05 44.83,37.04 IC4.11 44.83,35.74 45.91,34.66 45.91,27.54 IC3.11 | v54.06,39.76 X1.6
  Bottom 0.15: v44.08,37.05 47.18,37.05 49.89,39.76 v54.06,39.76 | v16.22,35.76 16.51,36.05 27.62,36.05 29.5,34.16 35.94,34.16 38.8,37.03 v39.88,37.03
D8  (via drill 0.3)
  Top 0.15: X1.64 61.84,8.7 61.81,8.72 61.4,8.72 61.07,9.05 60.39,9.05 57.14,5.8 v57.14,5.03 | v49.77,5.82 49.38,6.2 IC2.18
  Bottom 0.15: v57.14,5.03 50.57,5.03 v49.77,5.82
D9  (via drill 0.3)
  Top 0.15: X1.65 61.91,7.45 59.46,7.45 58.03,6.03 v58.03,5.66 | v48.76,5.77 48.74,5.78 IC2.17
  Bottom 0.15: v58.03,5.66 58.03,4.97 57.35,4.29 56.77,4.29 56.48,4.58 49.94,4.58 v48.76,5.77
D10  (via drill 0.3)
  Top 0.15: X1.66 61.84,6.03 59.4,6.03 58.81,5.45 v58.81,5 | v48.62,4.71 48.08,5.26 IC2.16
  Bottom 0.15: v48.62,4.71 49.13,4.2 56.22,4.2 56.52,3.91 57.52,3.91 58.61,5 v58.81,5
D11  (via drill 0.3)
  Top 0.15: v56.33,9.99 57.61,9.99 59.25,11.63 v59.25,26.12 | v60.72,42.96 61.89,42.96 X1.37 | v54.5,9.99 47.99,9.99 47.43,9.44 IC2.15
  Bottom 0.15: v54.5,9.99 v56.33,9.99 | v59.25,26.12 59.25,27.81 60.76,29.32 60.76,42.68 60.77,42.89 v60.72,42.96
D12  (via drill 0.3)
  Top 0.15: v58.51,25.11 58.71,24.9 58.71,11.64 57.74,10.67 v57.23,10.67 | v60.03,41.67 X1.38 | v53.73,10.67 53.39,10.33 47.69,10.33 46.77,9.41 IC2.14
  Bottom 0.15: v53.73,10.67 v57.23,10.67 | v58.51,25.11 58.51,27.64 60.38,29.51 60.38,41.32 v60.03,41.67
D13  (via drill 0.3)
  Top 0.15: v56.34,11.38 57.89,11.38 58.15,11.65 58.15,24.29 57.77,24.68 v57.77,26.12 | v59.66,40.4 X1.39 | v54.47,11.35 53.43,11.35 52.76,10.68 47.4,10.68 46.13,9.44 IC2.13
  Bottom 0.15: v54.47,11.35 56.25,11.35 v56.34,11.38 | v57.77,26.12 57.77,27.48 59.96,29.67 59.96,40.08 v59.66,40.4
D14  (via drill 0.3)
  Top 0.15: v57.2,11.99 57.23,12.01 57.65,12.43 57.65,24.02 57.04,24.63 v57.04,25.11 | v59.33,39.1 62.2,39.1 62.29,39.1 X1.40 | v53.7,11.99 53.46,11.99 52.47,11 47.05,11 45.48,9.42 IC2.12
  Bottom 0.15: v53.7,11.99 v57.2,11.99 | v57.04,25.11 57.04,27.31 59.58,29.86 59.58,38.86 v59.33,39.1
D15  (via drill 0.3)
  Top 0.15: v56.34,12.59 56.58,12.62 57.11,13.16 57.11,23.76 56.3,24.57 v56.3,26.15 | v58.91,37.86 X1.41 | v54.53,12.62 53.42,12.62 52.18,11.38 46.8,11.38 44.83,9.44 IC2.11
  Bottom 0.15: v54.53,12.62 v56.34,12.59 | v56.3,26.15 56.3,27.18 59.2,30.08 59.2,37.57 v58.91,37.86
DO0  (via drill 0.3)
  Top 0.15: IC7.9 32.16,37.27 v32.68,37.78 | IC4.2 50.03,44.14 50.03,45.79 49.49,46.33 v48.36,46.33
  Bottom 0.15: v32.68,37.78 32.68,42.46 36.55,46.33 v48.36,46.33
DO1  (via drill 0.3)
  Top 0.15: IC7.10 31.36,37.7 v31.43,37.78 | v49.35,45.22 49.35,42.42 IC4.3
  Bottom 0.15: v31.43,37.78 31.43,41.92 36.59,47.05 48.62,47.07 49.34,46.35 49.34,45.26 v49.35,45.22
DO2  (via drill 0.3)
  Top 0.15: IC7.13 v28.96,42.32 | IC4.4 48.73,45.01 46.67,47.07 v35.43,47.07
  Bottom 0.15: v28.96,42.32 32.34,45.7 34.61,45.7 35.43,46.53 v35.43,47.07
DO3  (via drill 0.3)
  Top 0.15: IC7.14 28.16,42.75 v28.96,43.54 | IC4.5 48.08,45.15 46.86,46.37 v34.26,46.37
  Bottom 0.15: v34.26,46.37 31.78,46.37 v28.96,43.54
DO4  (via drill 0.3)
  Top 0.15: IC7.31 28.16,33.8 v29.5,35.13 | v47.4,44.81 47.43,44.7 IC4.6
  Bottom 0.15: v29.5,35.13 30.37,36 30.4,36.08 33.76,36.07 33.15,36.08 35.62,36.08 42.99,43.45 42.99,44.35 43.45,44.81 45.94,44.81 v47.4,44.81
DO5  (via drill 0.3)
  Top 0.15: IC7.32 28.96,33.1 30.53,34.67 v30.5,35.15 | v46.71,43.85 46.78,43.74 IC4.7
  Bottom 0.15: v46.71,43.85 46.09,44.47 43.75,44.47 43.4,44.14 43.4,43.4 35.71,35.71 31.06,35.71 v30.5,35.15
DO6  (via drill 0.3)
  Top 0.15: IC7.35 31.36,34.97 v31.53,35.12 | v45.71,43.63 46.13,43.26 IC4.8
  Bottom 0.15: v31.53,35.12 32.18,34.52 32.44,34.51 33.04,34.52 33.39,34.51 33.48,34.51 35.56,34.52 44.34,43.29 44.68,43.64 v45.71,43.63
DO7  (via drill 0.3)
  Top 0.15: IC7.36 32.16,34.4 32.64,34.87 v32.64,35.13 | v43.99,43.82 44.1,43.61 44.81,43.61 45.47,42.95 IC4.9
  Bottom 0.15: v32.64,35.13 32.65,35.15 33.37,35.13 35.64,35.13 43.98,43.48 v43.99,43.82
DO8  (via drill 0.3)
  Top 0.15: v50.53,13.56 50.03,14.08 IC2.2 50.01,14.76 50.01,15.28 50.26,15.54 50.26,21.32 50.75,21.8 IC3.2 | IC6.9 v32.16,13.94
  Bottom 0.15: v50.53,13.56 50.11,14.01 41.69,14.01 40.7,13.03 36.83,13.03 36.39,12.59 34.58,12.59 33.22,13.94 v32.16,13.94
DO9  (via drill 0.3)
  Top 0.15: v49.57,13.32 49.36,13.52 IC2.3 49.37,15.25 49.85,15.73 49.85,21.51 50.79,22.45 IC3.3 | v31.35,13.32 31.36,13.33 IC6.10
  Bottom 0.15: v49.57,13.32 49.26,13.63 41.8,13.63 40.82,12.65 36.99,12.65 36.61,12.27 34.32,12.27 33.34,13.22 31.5,13.22 31.4,13.32 v31.35,13.32
DO10  (via drill 0.3)
  Top 0.15: IC6.13 28.98,14.83 28.98,14.53 v29.67,13.84 | v48.69,12.97 48.69,13.92 IC2.4 48.7,14.76 48.7,15.25 49.4,15.95 49.4,21.69 50.82,23.1 IC3.4 50.87,23.1
  Bottom 0.15: v48.69,12.97 48.4,13.25 41.94,13.25 40.96,12.27 37.18,12.27 36.83,11.92 34.04,11.92 33.27,12.68 30.83,12.68 v29.67,13.84
DO11  (via drill 0.3)
  Top 0.15: IC6.14 28.16,14.4 28.17,14.4 v28.72,13.85 | v47.71,12.65 48.06,12.93 48.06,14.65 IC2.5 48.07,15.28 48.96,16.17 48.96,21.82 50.89,23.75 IC3.5
  Bottom 0.15: v47.71,12.65 47.39,12.93 42.16,12.93 41.15,11.92 37.43,11.92 37.12,11.6 33.85,11.6 33.15,12.3 30.26,12.3 28.72,13.84 v28.72,13.85
DO12  (via drill 0.3)
  Top 0.15: v28.16,7.25 IC6.31 | 50.84,24.4 IC3.6 50.82,24.4 48.58,22.16 48.58,16.55 47.4,15.38 47.4,14.77 IC2.6 47.43,13.28 v42,7.85 v41.99,7.85
  Bottom 0.15: v28.16,7.25 34.21,7.25 35.05,8.08 35.52,8.08 36.07,7.54 41.68,7.54 v41.99,7.85
DO13  (via drill 0.3)
  Top 0.15: v28.94,7.9 28.94,10.12 IC6.32 | 50.85,25.05 IC3.7 50.86,25.05 48.16,22.36 48.16,16.85 46.82,15.5 IC2.7 46.78,13.17 42.13,8.52 41.5,8.52 v41.19,8.2
  Bottom 0.15: v41.18,8.2 v41.19,8.2 40.92,7.94 36.14,7.94 35.61,8.47 34.94,8.47 34.04,7.57 29.4,7.57 29.07,7.9 v28.94,7.9
DO14  (via drill 0.3)
  Top 0.15: v31.36,8.6 IC6.35 | IC3.8 50.65,25.7 50.28,25.34 50.28,25.08 47.72,22.52 47.72,17.07 46.77,16.12 46.77,16.11 46.13,15.47 IC2.8 46.13,13.01 43.19,10.07 v42.68,10.07
  Bottom 0.15: v31.36,8.6 31.69,8.27 33.59,8.27 34.87,9.57 42.18,9.57 v42.68,10.07
DO15  (via drill 0.3)
  Top 0.15: v32.39,8.92 32.16,9.12 32.17,10.14 IC6.36 | IC3.9 50.38,26.35 49.88,25.86 49.88,25.25 47.28,22.65 47.28,17.35 45.47,15.54 IC2.9 45.48,12.89 43.73,11.14 42.93,11.14 v42.92,11.15
  Bottom 0.15: v42.92,11.15 41.66,9.9 34.65,9.9 34.64,9.92 33.64,8.92 v32.39,8.92
GND  (via drill 0.3, 0.5)
  Top 0.406: X1.1 62.62,46.11 v60.61,46.12 | 62.93,44.21 X1.36 58.63,44.21 58.62,44.2 v58.54,44.2 | X1.34 62.6,4.2 v60.99,4.2
  other vias: 58.51,47.54 52.23,47.76 56.92,35.82 53.76,23.85 51.66,12.2 39.47,8.8 39.47,5.44 27.31,22.83 30.2,26.87 38.25,45.2 40.77,43.88 12.39,27.66 43.57,27.79 39.95,24.2 30.84,42.84 30.46,47.38 28.43,47.38 41.22,38.73 29.64,37.7 22.17,8.17 21.47,12.2 30.92,11.46 25.31,7.88 27.66,12.48 17.15,9.79 20.01,31.92 54.49,6.23 54.33,20.1 56.32,20.1 49.99,27.81 56.51,8.17 43.76,8.07 49.43,37.99 27.44,37.73 33.83,41.45 18.01,7.88 41.47,34.32 33.19,27.5 33.76,38.81 33.34,22.99 5.21,10.86 13.06,8.2 10.93,38.33 17.5,28.39 8.04,42.74 5.44,46.96 1.31,44.17 5.53,6.07 13.69,5.31 52.35,1.36 23.95,5.15 43.45,39.22 5.91,25.72 27.22,27.03 46.99,7.5 51.64,5.91 51.1,27.93 41.53,11.04 43.17,12.16 46.51,20.17 39.6,10.9 49.96,33
  pour Top (isolate 0.254): -0.41,49.96 66.28,49.86 66.28,-0.34 -0.51,-0.18
  pour Bottom (isolate 0.254): -0.54,49.96 66.25,49.86 66.28,-0.4 -0.51,-0.3
N$1  (via drill 0.3)
  Top 0.15: v7.43,12.38 7.72,12.17 IC5.24
  Bottom 0.15: 7.41,12.38 v7.43,12.38 6.89,12.92 6.89,26.21 2.86,30.24 2.87,32.66 3.52,33.32 SV1.2
N$2
  Top 0.15: SV1.3 4.95,35.85 3.54,35.85 2.88,35.2 2.88,30.21 6.92,26.16 IC5.11
N$3
  Top 0.15: IC5.10 7.72,32.38 7.75,37.33 6.69,38.39 5.58,38.36 SV1.4
N$4
  Top 0.15: IC5.9 8.53,38.72 6.3,40.96 5.84,40.96 SV1.5
N$8
  Top 0.15: IC5.14 3.92,18.64 3.59,18.97 3.59,20.49 5.05,21.95 5.05,24.06 SW1.2
OE  (via drill 0.3)
  Top 0.15: IC7.41 36.16,23.47 35.76,23.08 35.76,18.53 35.69,18.46 35.69,14.13 35.56,14.01 35.56,13.61 36.16,13.01 v36.16,8.93 36.16,9.92 36.13,10.13 IC6.41 | IC5.16 3.37,17.04 v3.33,17 | X1.9 61.8,35.95 59.84,34 56.16,34 v55.38,33.22 | IC7.41 | IC7.41 36.16,26.65 35.75,27.06 v35.75,30.71
  Bottom 0.15: v3.33,17 3.33,11.57 5.84,9.06 28.7,9.06 29.83,7.93 33.86,7.93 34.86,8.93 v36.16,8.93 | v55.38,33.22 55.61,33.22 55.97,32.86 55.97,32.01 54.64,30.68 42.01,30.68 41.69,31 36.1,31 v35.75,30.71
OE_EVEN  (via drill 0.3)
  Top 0.15: v10.13,12.24 IC5.27 | IC4.19 50.03,34.84 49.17,34 49.17,25.31 46.55,22.68 v46.55,22.27 | v40,15.95 42.04,17.99 v42.04,21.65
  Bottom 0.15: v46.55,22.27 46.11,21.82 42.32,21.85 v42.04,21.65 | v40,15.95 39.92,16.02 35.43,16.02 34.44,15.06 20.22,15.06 17.4,12.24 v10.13,12.24
OE_ODD  (via drill 0.3)
  Top 0.15: IC5.22 6.08,11.09 v6.07,8.38 | v50.65,2.3 50.66,5.97 50.03,6.6 IC2.19
  Bottom 0.15: 50.65,2.33 v50.65,2.3 50.38,2.58 19.6,2.58 15.28,6.95 7.5,6.95 v6.07,8.38
OE_ODD_LOW  (via drill 0.3)
  Top 0.15: IC5.23 6.93,9.5 6.93,8.57 arc90 v7.16,8.34 | IC3.19 45.36,21.79 44.12,21.79 43.68,21.35 43.68,18.68 40.67,15.7 40.67,8.84 38.31,6.48 v17.04,6.48
  Bottom 0.15: v17.04,6.48 16.29,6.49 15.47,7.3 8.21,7.3 v7.16,8.34
REG#  (via drill 0.3)
  Top 0.15: X1.61 60.76,12.46 57.77,9.47 57.77,7.57 53.57,3.37 v53.15,3.37 | 19.89,7.92 v19.9,7.94 20.26,8.29 20.26,13.73 20.24,13.87 19.46,14.64 17.92,14.64 IC5.37
  Bottom 0.15: v53.15,3.37 22.03,3.35 21.37,4 21.37,7.53 20.97,7.94 v19.9,7.94
WE  (via drill 0.3)
  Top 0.15: v26.43,37.81 25.76,37.14 IC7.17 25.76,33.65 26.11,33.31 26.12,28.51 25.37,27.76 25.36,24.21 25.75,23.82 25.75,21.37 IC6.17 | v29.58,38.99 29.58,40.21 29.97,40.62 36.65,40.62 37.36,41.32 50.08,41.32 | 50.08,41.32 50.62,41.32 50.68,41.33 IC4.1 | X1.15 60.69,28.33 60.53,28.49 56.08,28.49 | IC2.1 50.68,20.62 IC3.1 51.23,21.17 53.78,21.17 54.6,21.98 54.6,27.29 55.8,28.49 56.08,28.49 | v53.66,33.26 53.66,33.18 53.55,33.07 53.54,31.03 56.08,28.49 | v52.5,35.25 52.55,35.31 51.45,36.41 51.45,39.95 50.08,41.32
  Bottom 0.15: v26.43,37.81 27.58,38.95 v29.58,38.99 | v52.5,35.25 52.51,33.77 53.02,33.26 v53.66,33.26

### Text on the board
tNames: 4MB SRAM v1.2 by strim_ & jarob